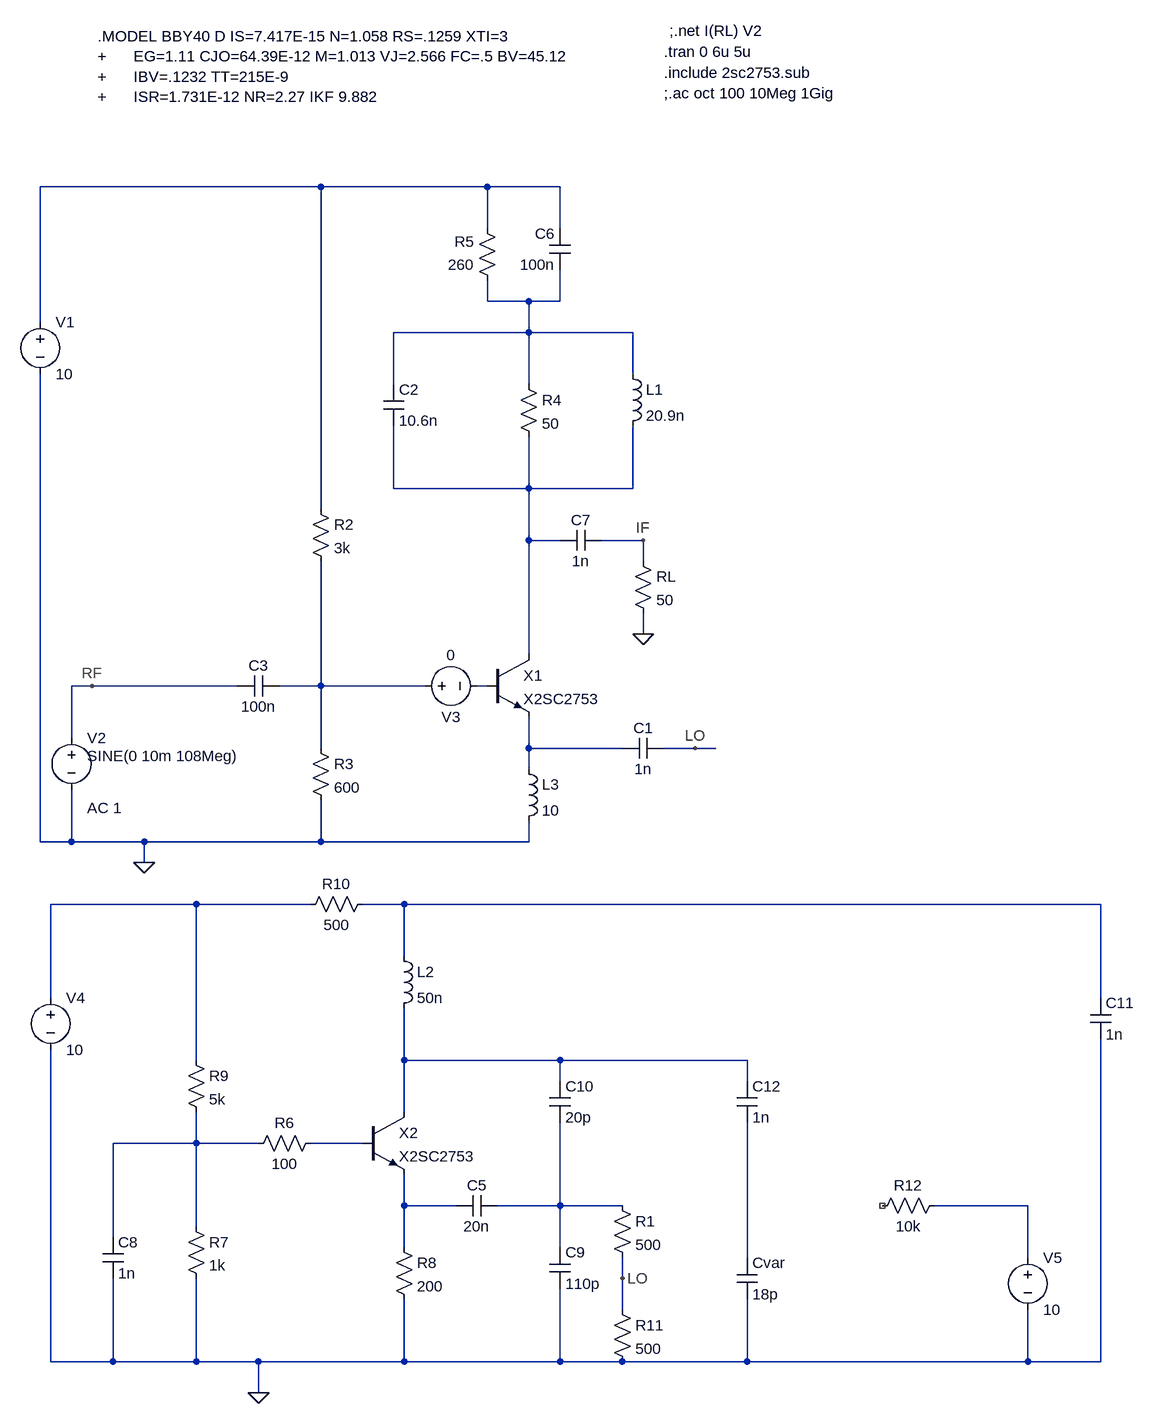
[diagram p0: schematic mixer-oscillator.asc]
mixer-oscillator.asc, the LTspice schematic file:
Version 4
SHEET 1 1844 2228
WIRE -16 -256 -448 -256
WIRE 240 -256 -16 -256
WIRE 352 -256 240 -256
WIRE 240 -192 240 -256
WIRE 352 -192 352 -256
WIRE 240 -80 240 -112
WIRE 304 -80 240 -80
WIRE 352 -80 352 -128
WIRE 352 -80 304 -80
WIRE -448 -48 -448 -256
WIRE 304 -32 304 -80
WIRE 304 -32 96 -32
WIRE 464 -32 304 -32
WIRE 464 32 464 -32
WIRE 96 48 96 -32
WIRE 304 48 304 -32
WIRE 96 208 96 112
WIRE 304 208 304 128
WIRE 304 208 96 208
WIRE 464 208 464 112
WIRE 464 208 304 208
WIRE -16 240 -16 -256
WIRE 304 288 304 208
WIRE 352 288 304 288
WIRE 480 288 416 288
WIRE 480 320 480 288
WIRE 480 432 480 400
WIRE 304 464 304 288
WIRE -368 512 -400 512
WIRE -144 512 -368 512
WIRE -16 512 -16 320
WIRE -16 512 -80 512
WIRE 144 512 -16 512
WIRE 240 512 224 512
WIRE -400 592 -400 512
WIRE -16 608 -16 512
WIRE 304 608 304 560
WIRE 448 608 304 608
WIRE 560 608 512 608
WIRE 592 608 560 608
WIRE 304 640 304 608
WIRE -448 752 -448 32
WIRE -400 752 -400 672
WIRE -400 752 -448 752
WIRE -288 752 -400 752
WIRE -16 752 -16 688
WIRE -16 752 -288 752
WIRE 304 752 304 720
WIRE 304 752 -16 752
WIRE -288 784 -288 752
WIRE -208 848 -432 848
WIRE -32 848 -208 848
WIRE 112 848 48 848
WIRE 1184 848 112 848
WIRE 112 928 112 848
WIRE -432 992 -432 848
WIRE 1184 992 1184 848
WIRE -208 1088 -208 848
WIRE 112 1088 112 1008
WIRE 352 1088 112 1088
WIRE 640 1088 352 1088
WIRE 352 1120 352 1088
WIRE 640 1120 640 1088
WIRE 112 1168 112 1088
WIRE -208 1216 -208 1168
WIRE -208 1216 -336 1216
WIRE -112 1216 -208 1216
WIRE 48 1216 -32 1216
WIRE 112 1312 112 1264
WIRE 192 1312 112 1312
WIRE 352 1312 352 1184
WIRE 352 1312 256 1312
WIRE 448 1312 352 1312
WIRE 1072 1312 928 1312
WIRE -208 1344 -208 1216
WIRE -336 1360 -336 1216
WIRE 112 1376 112 1312
WIRE 352 1376 352 1312
WIRE 640 1392 640 1184
WIRE 1072 1392 1072 1312
WIRE 448 1424 448 1392
WIRE 448 1472 448 1424
WIRE -432 1552 -432 1072
WIRE -336 1552 -336 1424
WIRE -336 1552 -432 1552
WIRE -208 1552 -208 1424
WIRE -208 1552 -336 1552
WIRE -112 1552 -208 1552
WIRE 112 1552 112 1456
WIRE 112 1552 -112 1552
WIRE 352 1552 352 1440
WIRE 352 1552 112 1552
WIRE 448 1552 352 1552
WIRE 640 1552 640 1456
WIRE 640 1552 448 1552
WIRE 1072 1552 1072 1472
WIRE 1072 1552 640 1552
WIRE 1184 1552 1184 1056
WIRE 1184 1552 1072 1552
WIRE -112 1600 -112 1552
FLAG -288 784 0
FLAG -112 1600 0
FLAG -368 512 RF
FLAG 448 1424 LO
FLAG 480 288 IF
FLAG 480 432 0
FLAG 560 608 LO
SYMBOL npn 240 464 R0
SYMATTR InstName X1
SYMATTR Value X2SC2753
SYMATTR Prefix X
SYMBOL Cap 80 48 R0
SYMATTR InstName C2
SYMATTR Value 10.6n
SYMBOL ind 448 16 R0
SYMATTR InstName L1
SYMATTR Value 20.9n
SYMBOL Cap -80 496 R90
WINDOW 0 0 32 VBottom 2
WINDOW 3 32 32 VTop 2
SYMATTR InstName C3
SYMATTR Value 100n
SYMBOL voltage -448 -64 R0
SYMATTR InstName V1
SYMATTR Value 10
SYMBOL voltage -400 576 R0
WINDOW 3 24 44 Left 2
WINDOW 123 24 124 Left 2
WINDOW 39 24 44 Left 2
SYMATTR Value SINE(0 10m 108Meg)
SYMATTR Value2 AC 1
SYMATTR InstName V2
SYMBOL Res -32 224 R0
SYMATTR InstName R2
SYMATTR Value 3k
SYMBOL Res -32 592 R0
SYMATTR InstName R3
SYMATTR Value 600
SYMBOL cap -352 1360 R0
SYMATTR InstName C8
SYMATTR Value 1n
SYMBOL res -224 1328 R0
SYMATTR InstName R7
SYMATTR Value 1k
SYMBOL res 96 1360 R0
SYMATTR InstName R8
SYMATTR Value 200
SYMBOL res -224 1072 R0
SYMATTR InstName R9
SYMATTR Value 5k
SYMBOL res 64 832 R90
WINDOW 0 0 56 VBottom 2
WINDOW 3 32 56 VTop 2
SYMATTR InstName R10
SYMATTR Value 500
SYMBOL cap 336 1376 R0
SYMATTR InstName C9
SYMATTR Value 110p
SYMBOL cap 336 1120 R0
SYMATTR InstName C10
SYMATTR Value 20p
SYMBOL cap 1168 992 R0
SYMATTR InstName C11
SYMATTR Value 1n
SYMBOL cap 624 1120 R0
SYMATTR InstName C12
SYMATTR Value 1n
SYMBOL ind 96 912 R0
SYMATTR InstName L2
SYMATTR Value 50n
SYMBOL npn 48 1168 R0
SYMATTR InstName X2
SYMATTR Value X2SC2753
SYMATTR Prefix X
SYMBOL voltage -432 976 R0
WINDOW 123 0 0 Left 0
WINDOW 39 0 0 Left 0
SYMATTR InstName V4
SYMATTR Value 10
SYMBOL res 944 1296 R90
WINDOW 0 0 56 VBottom 2
WINDOW 3 32 56 VTop 2
SYMATTR InstName R12
SYMATTR Value 10k
SYMBOL voltage 1072 1376 R0
WINDOW 123 0 0 Left 0
WINDOW 39 0 0 Left 0
SYMATTR InstName V5
SYMATTR Value 10
SYMBOL res -16 1200 R90
WINDOW 0 0 56 VBottom 2
WINDOW 3 32 56 VTop 2
SYMATTR InstName R6
SYMATTR Value 100
SYMBOL cap 512 592 R90
WINDOW 0 0 32 VBottom 2
WINDOW 3 32 32 VTop 2
SYMATTR InstName C1
SYMATTR Value 1n
SYMBOL res 288 32 R0
SYMATTR InstName R4
SYMATTR Value 50
SYMBOL cap 624 1392 R0
SYMATTR InstName Cvar
SYMATTR Value 18p
SYMBOL res 256 -96 R180
WINDOW 0 36 76 Left 2
WINDOW 3 36 40 Left 2
SYMATTR InstName R5
SYMATTR Value 260
SYMBOL res 464 304 R0
SYMATTR InstName RL
SYMATTR Value 50
SYMBOL cap 368 -128 R180
WINDOW 0 24 56 Left 2
WINDOW 3 24 8 Left 2
SYMATTR InstName C6
SYMATTR Value 100n
SYMBOL cap 416 272 R90
WINDOW 0 0 32 VBottom 2
WINDOW 3 32 32 VTop 2
SYMATTR InstName C7
SYMATTR Value 1n
SYMBOL voltage 128 512 R270
WINDOW 0 -32 56 VBottom 2
WINDOW 3 32 56 VTop 2
WINDOW 123 0 0 Left 0
WINDOW 39 0 0 Left 0
SYMATTR InstName V3
SYMATTR Value 0
SYMBOL ind 288 624 R0
SYMATTR InstName L3
SYMATTR Value 10
SYMBOL cap 256 1296 R90
WINDOW 0 0 32 VBottom 2
WINDOW 3 32 32 VTop 2
SYMATTR InstName C5
SYMATTR Value 20n
SYMBOL res 432 1296 R0
SYMATTR InstName R1
SYMATTR Value 500
SYMBOL res 432 1456 R0
SYMATTR InstName R11
SYMATTR Value 500
TEXT 512 -464 Left 2 !.tran 0 6u 5u
TEXT 512 -432 Left 2 !.include 2sc2753.sub
TEXT -360 -488 Left 2 !.MODEL BBY40 D IS=7.417E-15 N=1.058 RS=.1259 XTI=3 \n+      EG=1.11 CJO=64.39E-12 M=1.013 VJ=2.566 FC=.5 BV=45.12 \n+      IBV=.1232 TT=215E-9\n+      ISR=1.731E-12 NR=2.27 IKF 9.882
TEXT 512 -400 Left 2 !;.ac oct 100 10Meg 1Gig
TEXT 520 -496 Left 2 !;.net I(RL) V2

The netlist it stands for:
* mixer-oscillator.asc
XX1 N003 N005 N006 X2SC2753  ; pins C B E
C2 N002 N003 10.6n
L1 N002 N003 20.9n
C3 N004 RF 100n
V1 N001 0 10
V2 RF 0 SINE(0 10m 108Meg) AC 1
R2 N001 N004 3k
R3 N004 0 600
C8 N010 0 1n
R7 N010 0 1k
R8 N012 0 200
R9 N007 N010 5k
R10 N008 N007 500
C9 N013 0 110p
C10 N009 N013 20p
C11 N008 0 1n
C12 N009 N015 1n
L2 N008 N009 50n
XX2 N009 N011 N012 X2SC2753  ; pins C B E
V4 N007 0 10
R12 N014 NC_01 10k
V5 N014 0 10
R6 N011 N010 100
C1 LO N006 1n
R4 N002 N003 50
Cvar N015 0 18p
R5 N002 N001 260
RL IF 0 50
C6 N002 N001 100n
C7 IF N003 1n
V3 N004 N005 0
L3 N006 0 10
C5 N013 N012 20n
R1 N013 LO 500
R11 LO 0 500
.tran 0 6u 5u
.include 2sc2753.sub
.MODEL BBY40 D IS=7.417E-15 N=1.058 RS=.1259 XTI=3
+      EG=1.11 CJO=64.39E-12 M=1.013 VJ=2.566 FC=.5 BV=45.12
+      IBV=.1232 TT=215E-9
+      ISR=1.731E-12 NR=2.27 IKF 9.882
;.ac oct 100 10Meg 1Gig
;.net I(RL) V2
.backanno
.end